# EAGLE design 4x4keyboard (EAGLE 7.7.0)
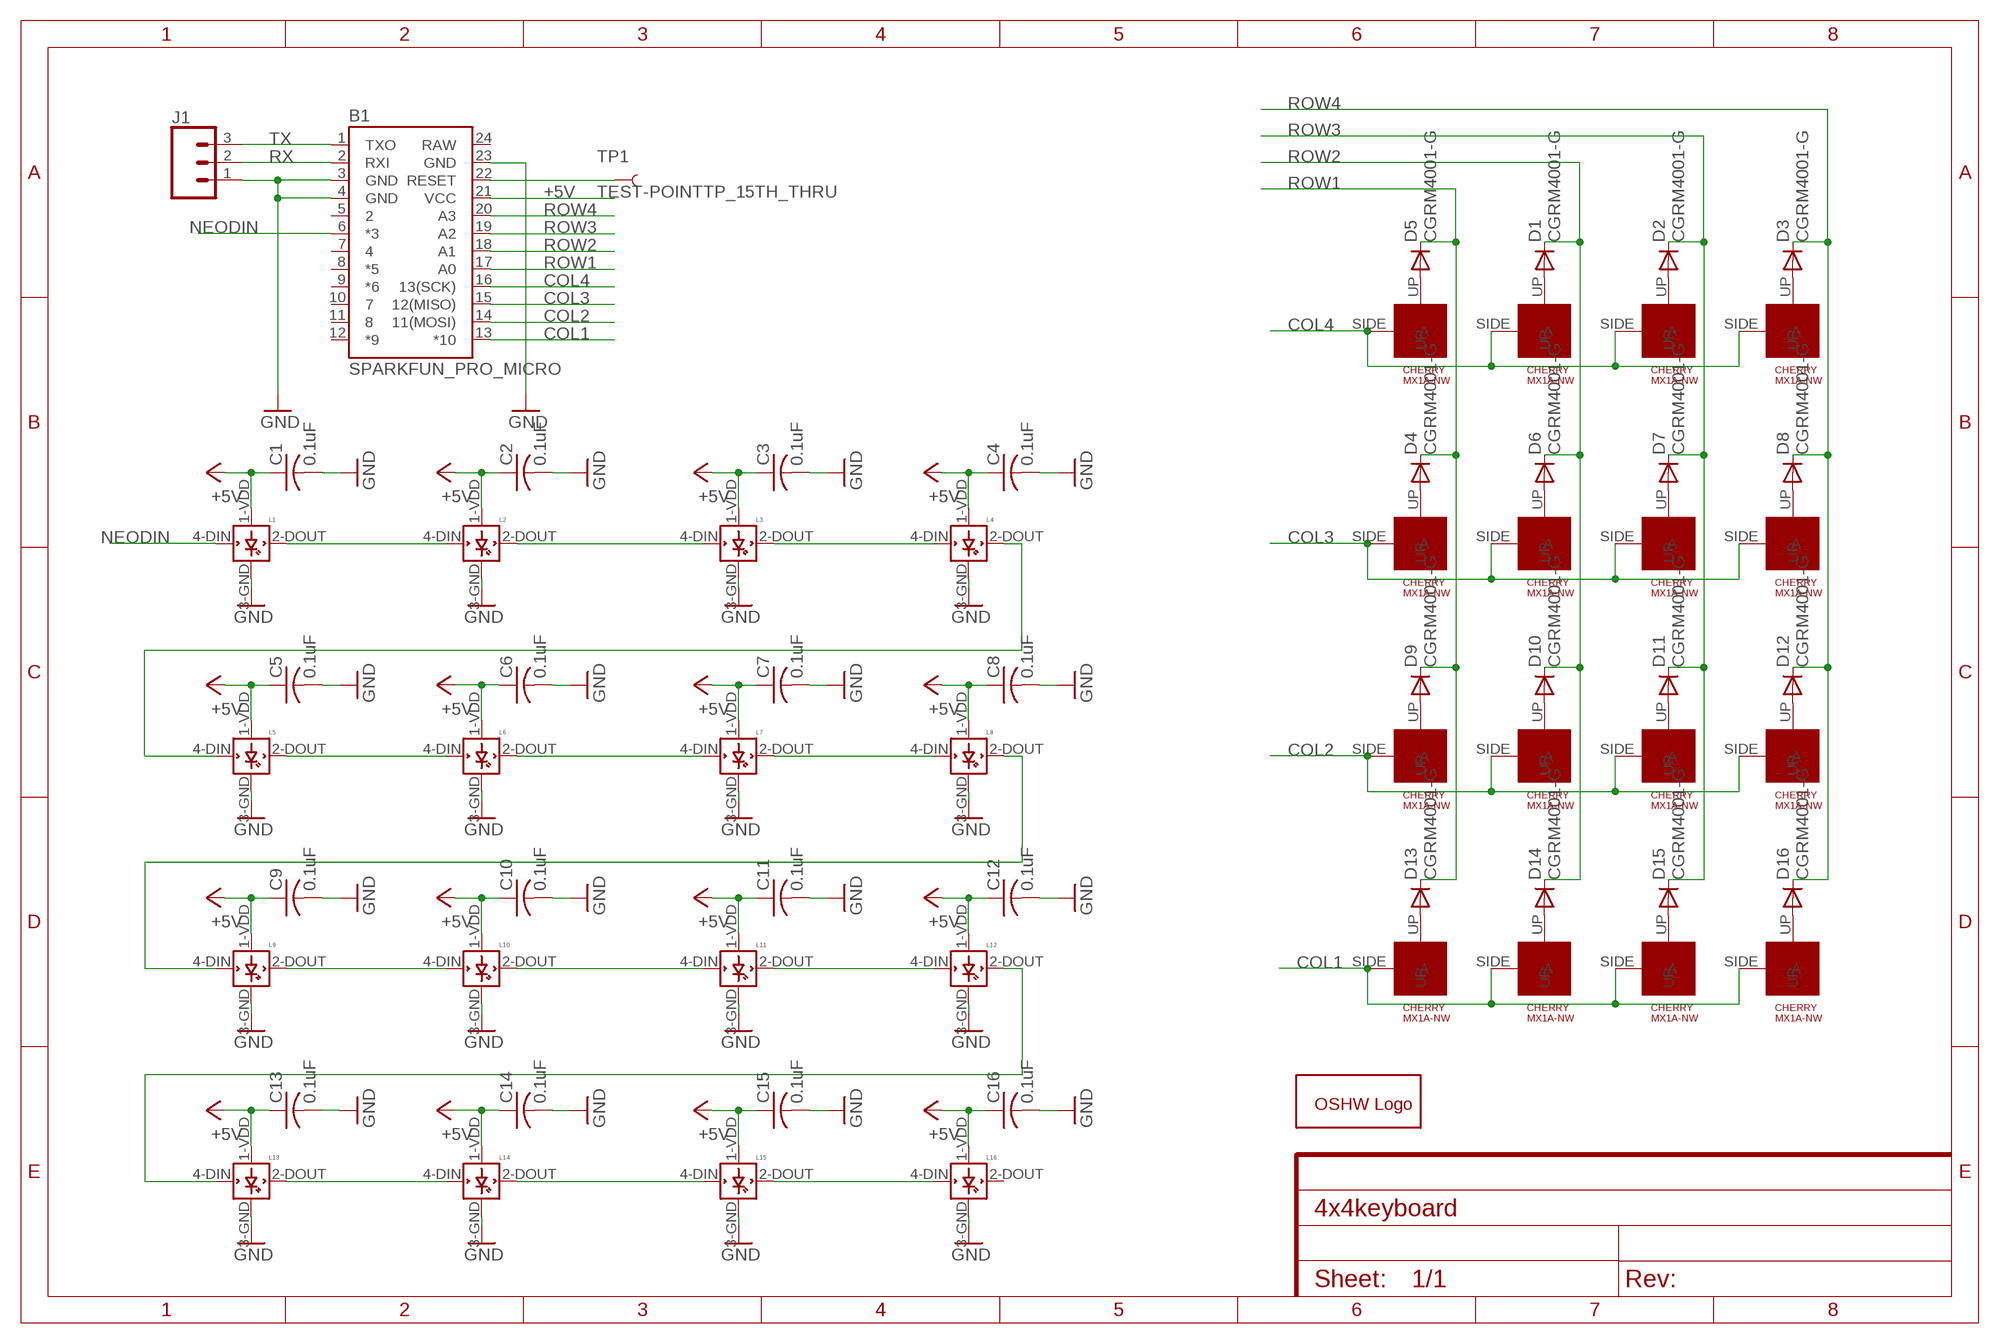
[diagram p0: schematic, sheet 1]

## Parts
B1  SPARKFUN_PRO_MICRO  [SPARKFUN_PRO_MICRO]
C1  0.1uF  C-USC0603  [C0603]
C2  0.1uF  C-USC0603  [C0603]
C3  0.1uF  C-USC0603  [C0603]
C4  0.1uF  C-USC0603  [C0603]
C5  0.1uF  C-USC0603  [C0603]
C6  0.1uF  C-USC0603  [C0603]
C7  0.1uF  C-USC0603  [C0603]
C8  0.1uF  C-USC0603  [C0603]
C9  0.1uF  C-USC0603  [C0603]
C10  0.1uF  C-USC0603  [C0603]
C11  0.1uF  C-USC0603  [C0603]
C12  0.1uF  C-USC0603  [C0603]
C13  0.1uF  C-USC0603  [C0603]
C14  0.1uF  C-USC0603  [C0603]
C15  0.1uF  C-USC0603  [C0603]
C16  0.1uF  C-USC0603  [C0603]
D1  CGRM4001-G  [SOD-123_MINI-SMA]
D2  CGRM4001-G  [SOD-123_MINI-SMA]
D3  CGRM4001-G  [SOD-123_MINI-SMA]
D4  CGRM4001-G  [SOD-123_MINI-SMA]
D5  CGRM4001-G  [SOD-123_MINI-SMA]
D6  CGRM4001-G  [SOD-123_MINI-SMA]
D7  CGRM4001-G  [SOD-123_MINI-SMA]
D8  CGRM4001-G  [SOD-123_MINI-SMA]
D9  CGRM4001-G  [SOD-123_MINI-SMA]
D10  CGRM4001-G  [SOD-123_MINI-SMA]
D11  CGRM4001-G  [SOD-123_MINI-SMA]
D12  CGRM4001-G  [SOD-123_MINI-SMA]
D13  CGRM4001-G  [SOD-123_MINI-SMA]
D14  CGRM4001-G  [SOD-123_MINI-SMA]
D15  CGRM4001-G  [SOD-123_MINI-SMA]
D16  CGRM4001-G  [SOD-123_MINI-SMA]
GOLD_ORB_SM1  OSHWLOGOLOGO5MM  [OSHW_5MM]
J1  CONN_03LOCK  [1X03_LOCK]
L1  WS2812B  [WS2812B]
L2  WS2812B  [WS2812B]
L3  WS2812B  [WS2812B]
L4  WS2812B  [WS2812B]
L5  WS2812B  [WS2812B]
L6  WS2812B  [WS2812B]
L7  WS2812B  [WS2812B]
L8  WS2812B  [WS2812B]
L9  WS2812B  [WS2812B]
L10  WS2812B  [WS2812B]
L11  WS2812B  [WS2812B]
L12  WS2812B  [WS2812B]
L13  WS2812B  [WS2812B]
L14  WS2812B  [WS2812B]
L15  WS2812B  [WS2812B]
L16  WS2812B  [WS2812B]
TP1  TEST-POINTTP_15TH_THRU  [TP_15TH]
U$1  CHERRY-MX1A-E1NW  [CHERRYMX-NN]
U$2  CHERRY-MX1A-E1NW  [CHERRYMX-NN]
U$3  CHERRY-MX1A-E1NW  [CHERRYMX-NN]
U$4  CHERRY-MX1A-E1NW  [CHERRYMX-NN]
U$7  CHERRY-MX1A-E1NW  [CHERRYMX-NN]
U$8  CHERRY-MX1A-E1NW  [CHERRYMX-NN]
U$9  CHERRY-MX1A-E1NW  [CHERRYMX-NN]
U$10  CHERRY-MX1A-E1NW  [CHERRYMX-NN]
U$19  CHERRY-MX1A-E1NW  [CHERRYMX-NN]
U$20  CHERRY-MX1A-E1NW  [CHERRYMX-NN]
U$21  CHERRY-MX1A-E1NW  [CHERRYMX-NN]
U$22  CHERRY-MX1A-E1NW  [CHERRYMX-NN]
U$25  CHERRY-MX1A-E1NW  [CHERRYMX-NN]
U$26  CHERRY-MX1A-E1NW  [CHERRYMX-NN]
U$27  CHERRY-MX1A-E1NW  [CHERRYMX-NN]
U$28  CHERRY-MX1A-E1NW  [CHERRYMX-NN]

## Nets
+5V: B1.21(VCC) C1.1 C2.1 C3.1 C4.1 C5.1 C6.1 C7.1 C8.1 C9.1 C10.1 C11.1 C12.1 C13.1 C14.1 C15.1 C16.1 L1.1-VDD(VDD) L2.1-VDD(VDD) L3.1-VDD(VDD) L4.1-VDD(VDD) L5.1-VDD(VDD) L6.1-VDD(VDD) L7.1-VDD(VDD) L8.1-VDD(VDD) L9.1-VDD(VDD) L10.1-VDD(VDD) L11.1-VDD(VDD) L12.1-VDD(VDD) L13.1-VDD(VDD) L14.1-VDD(VDD) L15.1-VDD(VDD) L16.1-VDD(VDD)
COL1: B1.13(*10) U$25.SIDE(A) U$26.SIDE(A) U$27.SIDE(A) U$28.SIDE(A)
COL2: B1.14(11(MOSI)) U$7.SIDE(A) U$8.SIDE(A) U$9.SIDE(A) U$10.SIDE(A)
COL3: B1.15(12(MISO)) U$1.SIDE(A) U$2.SIDE(A) U$3.SIDE(A) U$4.SIDE(A)
COL4: B1.16(13(SCK)) U$19.SIDE(A) U$20.SIDE(A) U$21.SIDE(A) U$22.SIDE(A)
GND: B1.3(GND) B1.4(GND) B1.23(GND) C1.2 C2.2 C3.2 C4.2 C5.2 C6.2 C7.2 C8.2 C9.2 C10.2 C11.2 C12.2 C13.2 C14.2 C15.2 C16.2 J1.1 L1.3-GND(GND) L2.3-GND(GND) L3.3-GND(GND) L4.3-GND(GND) L5.3-GND(GND) L6.3-GND(GND) L7.3-GND(GND) L8.3-GND(GND) L9.3-GND(GND) L10.3-GND(GND) L11.3-GND(GND) L12.3-GND(GND) L13.3-GND(GND) L14.3-GND(GND) L15.3-GND(GND) L16.3-GND(GND)
N$1: D5.A U$19.UP
N$2: D1.A U$20.UP
N$3: D2.A U$21.UP
N$4: D3.A U$22.UP
N$5: L1.2-DOUT(DOUT) L2.4-DIN(DIN)
N$6: L2.2-DOUT(DOUT) L3.4-DIN(DIN)
N$7: D4.A U$2.UP
N$8: D6.A U$1.UP
N$9: D7.A U$3.UP
N$10: D8.A U$4.UP
N$11: L3.2-DOUT(DOUT) L4.4-DIN(DIN)
N$12: L4.2-DOUT(DOUT) L5.4-DIN(DIN)
N$13: L5.2-DOUT(DOUT) L6.4-DIN(DIN)
N$14: L6.2-DOUT(DOUT) L7.4-DIN(DIN)
N$15: L7.2-DOUT(DOUT) L8.4-DIN(DIN)
N$16: L8.2-DOUT(DOUT) L9.4-DIN(DIN)
N$17: L9.2-DOUT(DOUT) L10.4-DIN(DIN)
N$18: L10.2-DOUT(DOUT) L11.4-DIN(DIN)
N$19: D9.A U$7.UP
N$20: D10.A U$8.UP
N$21: D11.A U$9.UP
N$22: D12.A U$10.UP
N$23: L11.2-DOUT(DOUT) L12.4-DIN(DIN)
N$24: L12.2-DOUT(DOUT) L13.4-DIN(DIN)
N$25: D13.A U$25.UP
N$26: D14.A U$26.UP
N$27: D15.A U$27.UP
N$28: D16.A U$28.UP
N$29: L13.2-DOUT(DOUT) L14.4-DIN(DIN)
N$30: L14.2-DOUT(DOUT) L15.4-DIN(DIN)
N$31: L15.2-DOUT(DOUT) L16.4-DIN(DIN)
NEODIN: B1.6(*3) L1.4-DIN(DIN)
RESET: B1.22(RESET) TP1.P$1
ROW1: B1.17(A0) D4.C D5.C D9.C D13.C
ROW2: B1.18(A1) D1.C D6.C D10.C D14.C
ROW3: B1.19(A2) D2.C D7.C D11.C D15.C
ROW4: B1.20(A3) D3.C D8.C D12.C D16.C
RX: B1.2(RXI) J1.2
TX: B1.1(TXO) J1.3
Unconnected: B1.5 B1.7 B1.8(*5) B1.9(*6) B1.10 B1.11 B1.12(*9) L16.2-DOUT(DOUT)

## Power pins joined to a net without a drawn wire
RAW: B1.24(RAW)

## Library data of the parts
B1 = SparkFun-Boards:SPARKFUN_PRO_MICRO: SparkFun Pro Micro Atmega32U4 compatible footprint. SparkFun Products: 3.3V/8MHz <https://www.sparkfun.com/products/12587> 5V/16MHz <https://www.sparkfun.com/products/12640>
C1-C16 = resistor:C-US: CAPACITOR, American symbol
D1-D16 = diode:CGRM400*-G: Molded plasitc,JEDEC SOD-123/Mini SMA Source: Comchip CGRM4001-G.pdf
GOLD_ORB_SM1 = oshw:OSHWLOGO: The OSHW logo for PCB layout
J1 = SparkFun-Connectors:CONN_03: Multi connection point. Often used as Generic Header-pin footprint for 0.1 inch spaced/style header connections On any of the 0.1 inch spaced packages, you can populate with these: Break Away Headers - Straight <https://www.sparkfun.com/products/116> (PRT-00116) Break Away Male Headers - Right Angle <https://www.sparkfun.com/products/553> (PRT-00553) Female Headers <https://www.sparkfun.com/products/115> (PRT-00115) Break Away Headers - Machine Pin <https://www.sparkfun.com/products/117> (PRT-00117) Break Away Female Headers - Swiss Machine Pin <https://www.sparkfun.com/products/743> (PRT-00743) Stackable Header - 3 Pin (Female, 0.1") <https://www.sparkfun.com/products/13875> (PRT-13875) For SCREWTERMINALS and SPRING TERMINALS visit here: Screw Terimnals on SparkFun.com <https://www.sparkfun.com/search/results?term=Screw+Terminals> (5mm/3.5mm/2.54mm spacing) This device is also useful as a general connection point to wire up your design to another part of your project. Our various solder wires solder well into these plated through hole pads. Hook-Up Wire - Assortment (Stranded, 22 AWG) <https://www.sparkfun.com/products/11375> (PRT-11375) Hook-Up Wire - Assortment (Solid Core, 22 AWG) <https://www.sparkfun.com/products/11367> (PRT-11367) View the entire wire category on our website here <https://www.sparkfun.com/categories/141> Special notes: Molex polarized connector foot print use with SKU : PRT-08232 with associated crimp pins and housings.
L1-L16 = adafruit:WS2812B
TP1 = SparkFun-Connectors:TEST-POINT: SparkFun Test Points Bare copper test points for troubleshooting or In-Circuit-Testing. These are used by our Production team for verifying production board runs using pogo-pins on test beds. SparkFun Products: SparkFun LSM9DS1 Breakout <https://www.sparkfun.com/products/13284> SparkFun PSOC <https://www.sparkfun.com/products/13714> SparkFun Load Cell Amplifier <https://www.sparkfun.com/products/13879>
U$1-U$4 U$7-U$10 U$19-U$22 U$25-U$28 = my_parts:CHERRY-MX1A-E1NW: Cherry MX NW key

## Board
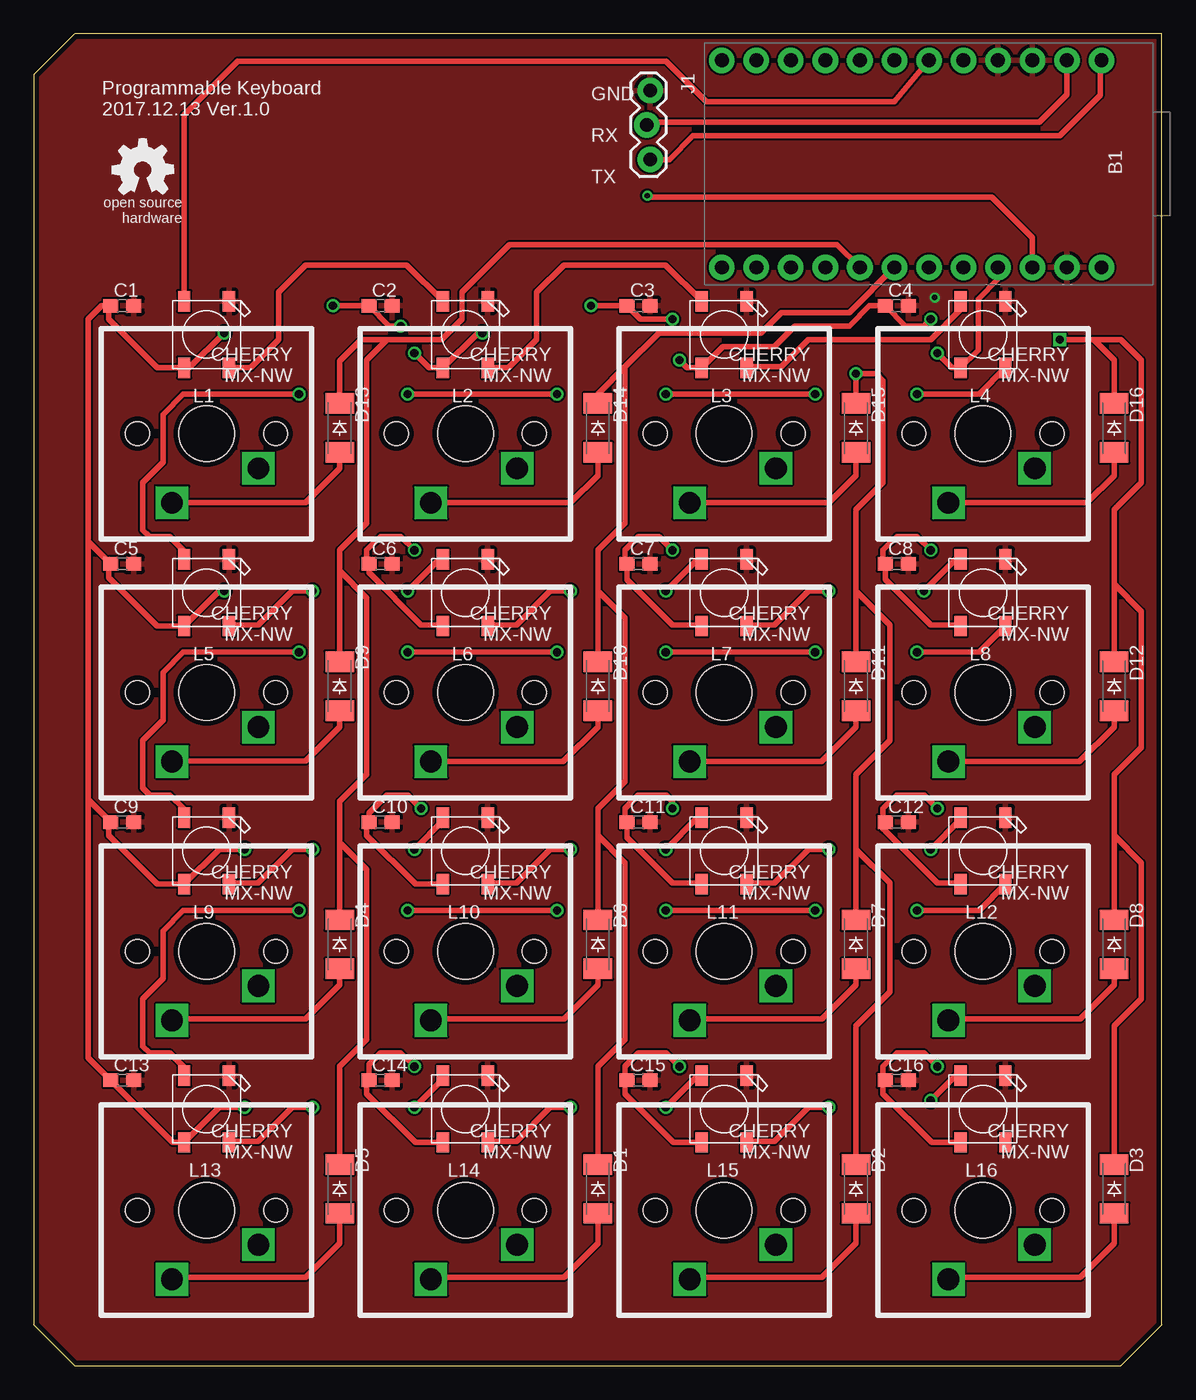
[diagram p1: board, top side]
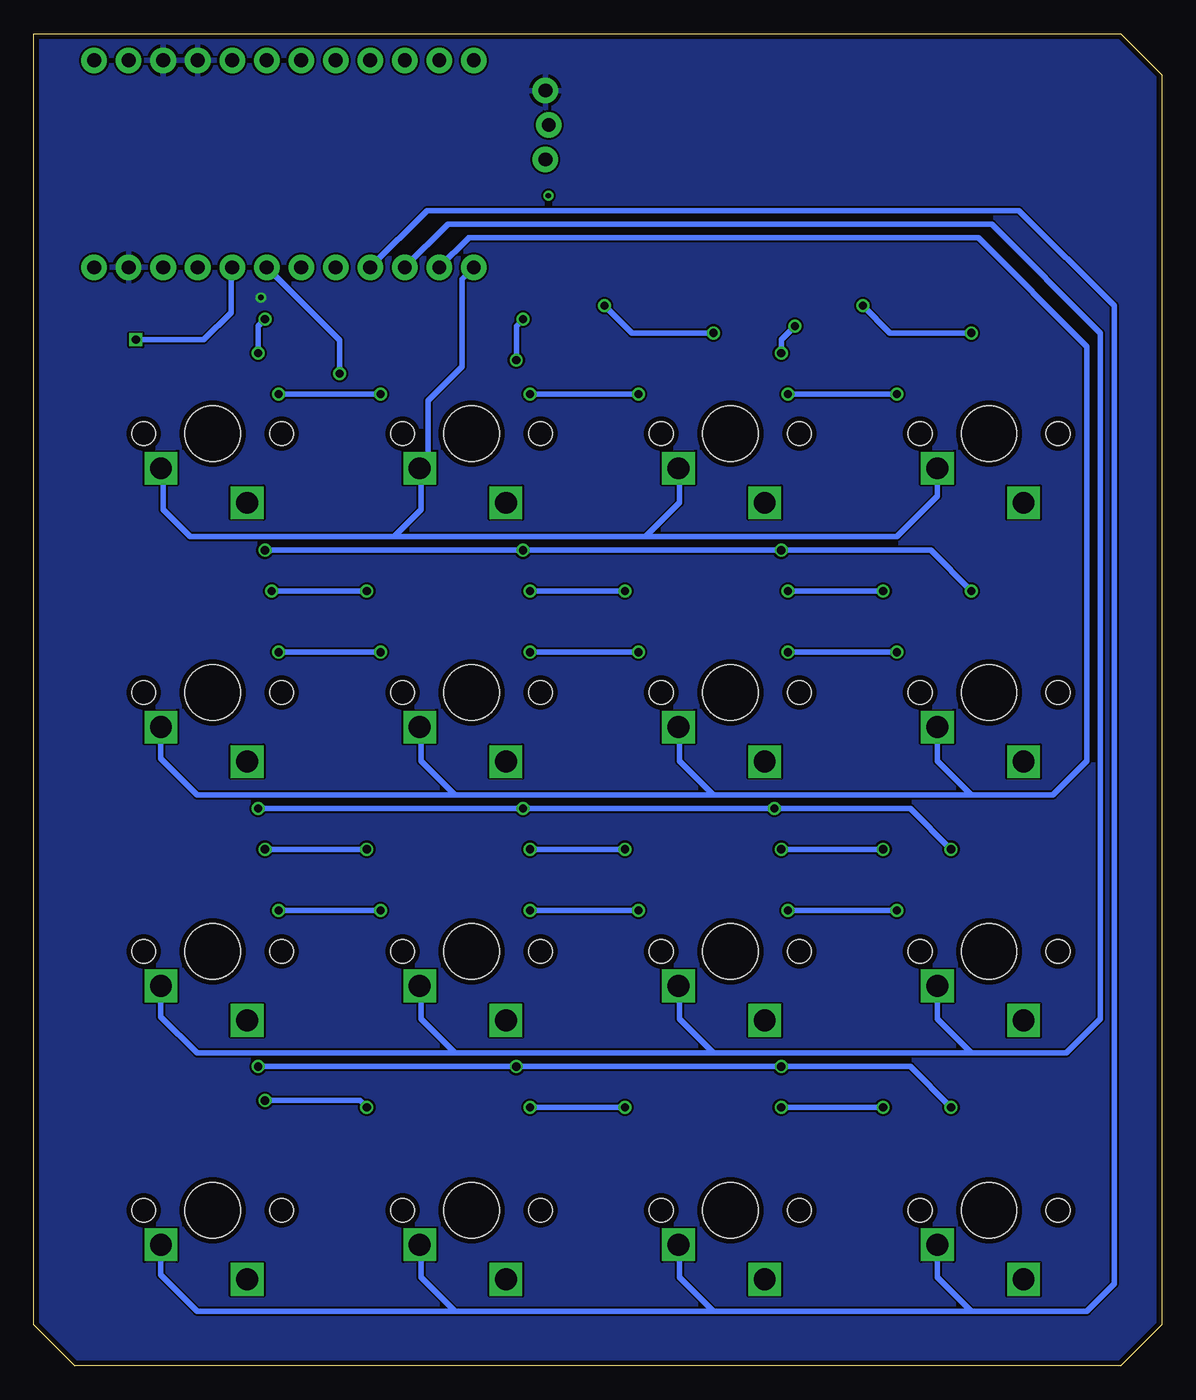
[diagram p2: board, bottom side, seen from below]

Size 83 x 98 mm. Coordinates in mm from the lower left corner, seen from the top.
Outline: 3,0 5,0 80,0 83,3 83,98 3,98 0,95 0,5 0,3 3,0
Copper layers (1*16): Top 0.0356mm / dielectric 1.5011mm / Bottom 0.0356mm
Design rules "LaenPCBOrder": minimum track width 6mil, minimum drill 13mil, track to track 6mil, track to pad 6mil, pad to pad 6mil, via to via 6mil, smd to smd 6mil, copper to edge 15mil, drill to drill 6mil, minimum pad ring 7mil, minimum via ring 7mil, stop-mask expansion 4mil, vias tented up to drill 0mil, thermal gap 10mil

### Footprints (pad centres in the part's own frame; a part is rotated, then mirrored left to right if it is on the bottom)
SPARKFUN_PRO_MICRO = drill 1.016 pad 1.88: 1 -7.62,12.7; 2 -7.62,10.16; 3 -7.62,7.62; 4 -7.62,5.08; 5 -7.62,2.54; 6 -7.62,0; 7 -7.62,-2.54; 8 -7.62,-5.08; 9 -7.62,-7.62; 10 -7.62,-10.16; 11 -7.62,-12.7; 12 -7.62,-15.24; 13 7.62,-15.24; 14 7.62,-12.7; 15 7.62,-10.16; 16 7.62,-7.62; 17 7.62,-5.08; 18 7.62,-2.54; 19 7.62,0; 20 7.62,2.54; 21 7.62,5.08; 22 7.62,7.62; 23 7.62,10.16; 24 7.62,12.7
C0603 = smd 1.1 x 1: 1 -0.85,0; 2 0.85,0
SOD-123_MINI-SMA = smd 1.5 x 2.1: A 1.8,0; C -1.8,0
1X03_LOCK = drill 1.016 pad 1.88: 1 0,0.127; 2 2.54,-0.127; 3 5.08,0.127
WS2812B = smd 1.5 x 0.9: 1-VDD 2.45,-1.65; 2-DOUT 2.45,1.65; 3-GND -2.45,1.65; 4-DIN -2.45,-1.65
TP_15TH = drill 0.381 pad 0.61: P$1 0,0
CHERRYMX-NN = drill 1.6 square: SIDE -3.81,2.54; UP 2.54,5.08 | hole 1.753: -5.08,0; 5.08,0 | hole 4.089: 0,0

### Placement (x,y rotation side)
B1  65.87,88.44 270 top
C1  6.5,78 0 top
C2  25.5,78 0 top
C3  44.5,78 0 top
C4  63.5,78 0 top
C5  6.5,59 0 top
C6  25.5,59 0 top
C7  44.5,59 0 top
C8  63.5,59 0 top
C9  6.5,40 0 top
C10  25.5,40 0 top
C11  44.5,40 0 top
C12  63.5,40 0 top
C13  6.5,21 0 top
C14  25.5,21 0 top
C15  44.5,21 0 top
C16  63.5,21 0 top
D1  41.5,13 270 top
D2  60.5,13 270 top
D3  79.5,13 270 top
D4  22.5,31 270 top
D5  22.5,13 270 top
D6  41.5,31 270 top
D7  60.5,31 270 top
D8  79.5,31 270 top
D9  22.5,50 270 top
D10  41.5,50 270 top
D11  60.5,50 270 top
D12  79.5,50 270 top
D13  22.5,69 270 top
D14  41.5,69 270 top
D15  60.5,69 270 top
D16  79.5,69 270 top
GOLD_ORB_SM1  8,88 0 top
J1  45.23,93.84 270 top
L1  12.7,75.88 270 top
L2  31.75,75.88 270 top
L3  50.8,75.88 270 top
L4  69.85,75.88 270 top
L5  12.7,56.88 270 top
L6  31.75,56.88 270 top
L7  50.8,56.88 270 top
L8  69.85,56.88 270 top
L9  12.7,37.88 270 top
L10  31.75,37.88 270 top
L11  50.8,37.88 270 top
L12  69.85,37.88 270 top
L13  12.7,18.88 270 top
L14  31.75,18.88 270 top
L15  50.8,18.88 270 top
L16  69.85,18.88 270 top
TP1  45.14,86.1 0 top
U$1  31.75,30.48 180 top
U$2  12.7,30.48 180 top
U$3  50.8,30.48 180 top
U$4  69.85,30.48 180 top
U$7  12.7,49.53 180 top
U$8  31.75,49.53 180 top
U$9  50.8,49.53 180 top
U$10  69.85,49.53 180 top
U$19  12.7,11.43 180 top
U$20  31.75,11.43 180 top
U$21  50.8,11.43 180 top
U$22  69.85,11.43 180 top
U$25  12.7,68.58 180 top
U$26  31.75,68.58 180 top
U$27  50.8,68.58 180 top
U$28  69.85,68.58 180 top

### Tracks (layer width: path | path; a pad name or v marks a point on that pad's centre or on a via)
+5V  (via drill 0.6)
  Top 0.406: B1.21 70.95,79.95 69.5,78.5 69.5,74.73 L4.1-VDD 67.57,73.43 v66.5,74.5 | v22,78 C2.1 26.15,76.5 v27,76.5 | v14,76 11.43,73.43 L1.1-VDD 9.07,73.43 5.5,77 5.5,77.85 C1.1 5,78 4,77 4,60.65 | v33,76 32.67,76 L2.1-VDD 29.07,73.43 v28,74.5 | v41,78 C3.1 44.65,77 v47,77 | v47.5,74 48.07,73.43 L3.1-VDD 50.72,75 54.5,75 56,76.5 60,76.5 61.5,78 C4.1 64.15,76.5 65.5,76.5 v66,77 | 4,60.65 C5.1 5.5,58.85 5.5,58 9.07,54.43 L5.1-VDD 13.62,57 v14,57 | 4,41.65 C9.1 5.5,39.85 5.5,39 9.07,35.43 L9.1-VDD 13.62,38 v15.5,38 | 4,41.65 4,60.65 | 4,41.65 4,22.65 C13.1 10.22,16.43 L13.1-VDD 13.62,19 v15.5,19 | v28,60 27,61 25.5,61 24.5,60 24.5,59.5 24.65,59.35 C6.1 24.65,58.35 28.5,54.5 30.03,54.5 L6.1-VDD | v47,60 46,61 44.5,61 43.5,60 43.5,59.15 C7.1 43.65,57.85 47,54.5 49.08,54.5 L7.1-VDD | v66,60 65,61 63.5,61 62.5,60 62.5,59.15 C8.1 62.65,57.85 66,54.5 68.13,54.5 L8.1-VDD | L10.1-VDD 28.07,35.43 24.5,39 24.5,39.85 C10.1 24.65,40.65 26,42 27.5,42 v28.5,41 | L11.1-VDD 49.08,35.5 47,35.5 43.65,38.85 C11.1 43.5,40.15 43.5,41 44.5,42 46.5,42 47,41.5 v47,41 | L12.1-VDD 68.13,35.5 66.5,35.5 62.65,39.35 | 62.65,39.35 C12.1 | 62.65,39.35 62.5,39.5 62.5,41 63.5,42 65.5,42 v66.5,41 | v28,22 27,23 25.5,23 24.65,22.15 C14.1 24.5,20.85 24.5,20 28.07,16.43 L14.1-VDD | C15.1 43.5,20.85 | 43.5,20.85 43.5,20 47.07,16.43 L15.1-VDD | C16.1 62.5,20.85 | 62.5,20.85 62.5,20 66.07,16.43 L16.1-VDD | 43.5,20.85 43.5,22 44.5,23 46.5,23 v47.5,22 | 62.5,20.85 62.5,22 63.5,23 65.5,23 v66.5,22
  Bottom 0.406: v22,78 20,76 v14,76 | v33,76 39,76 v41,78 | v27,76.5 28,75.5 v28,74.5 | v47,77 47.5,76.5 v47.5,74 | v66,77 66.5,76.5 v66.5,74.5 | v14,57 17,60 v28,60 v47,60 v66,60 | v15.5,38 18.5,41 v28.5,41 v47,41 v66.5,41 | v15.5,19 18.5,22 v28,22 v47.5,22 v66.5,22
COL1
  Bottom 0.406: B1.13 51.5,79.95 51.5,73.5 54,71 54,67 54.5,66.5 | 54.5,66.5 54.61,66.39 U$27.SIDE | U$28.SIDE 73.5,65.88 73.5,63 71.5,61 57.5,61 56.5,61 | 56.5,61 38,61 | 38,61 19.5,61 16.51,63.99 U$25.SIDE | U$26.SIDE 35.5,65.98 35.5,63.5 38,61 | 54.5,66.5 54.5,63 56.5,61
COL2
  Bottom 0.406: B1.14 51,82.99 51,83 13.5,83 5.5,75 5.5,44.5 8,42 13.5,42 14,42 | 14,42 33,42 | 33,42 52,42 | 52,42 71,42 73.66,44.66 U$10.SIDE | U$9.SIDE 54.5,46.88 54.5,44.5 52,42 | U$8.SIDE 35.5,46.93 35.5,44.5 33,42 | U$7.SIDE 16.5,44.5 14,42
COL3
  Bottom 0.406: B1.15 52.53,84 12.5,84 4.5,76 4.5,25.5 7,23 14,23 | 14,23 33,23 | 33,23 52,23 | 52,23 71,23 73.66,25.66 U$4.SIDE | U$3.SIDE 54.5,27.83 54.5,25.5 52,23 | U$1.SIDE 35.5,27.88 35.5,25.5 33,23 | U$2.SIDE 16.5,25.5 14,23
COL4
  Bottom 0.406: B1.16 54.07,85 10.5,85 3.5,78 3.5,6 5.5,4 14,4 | 14,4 33,4 | 33,4 52,4 | 52,4 71,4 73.66,6.66 U$22.SIDE | U$21.SIDE 54.5,8.78 54.5,6.5 52,4 | U$20.SIDE 35.5,8.83 35.5,6.5 33,4 | U$19.SIDE 16.5,6.5 14,4
GND  (via drill 0.4)
  other vias: 66.3,78.6
  pour Bottom: 0,97.84 82.79,98.11 82.79,-0.73 0,0
  pour Top: 0,97.84 82.79,97.84 82.79,0 0,0
N$1
  Top 0.406: D5.A 22.5,9 20,6.5 10.31,6.5 U$19.UP
N$2
  Top 0.406: D1.A 41.5,9 39,6.5 29.36,6.5 U$20.UP
N$3
  Top 0.406: D2.A 60.5,9 58,6.5 48.41,6.5 U$21.UP
N$4
  Top 0.406: D3.A 79.5,9 77,6.5 67.46,6.5 U$22.UP
N$5
  Top 0.406: L1.2-DOUT 15.93,73.43 18,75.5 18,79 20,81 27.43,81 L2.4-DIN
N$6
  Top 0.406: L2.2-DOUT 34.93,73.43 37,75.5 37,79 39,81 46.48,81 L3.4-DIN
N$7
  Top 0.406: D4.A 22.5,28 20,25.5 10.26,25.5 U$2.UP
N$8
  Top 0.406: D6.A 41.5,28 39,25.5 29.31,25.5 U$1.UP
N$9
  Top 0.406: D7.A 60.5,28 58,25.5 48.36,25.5 U$3.UP
N$10
  Top 0.406: D8.A 79.5,28 77,25.5 67.41,25.5 U$4.UP
N$11
  Top 0.406: L4.4-DIN 68.2,77.7 66,75.5 57,75.5 55,73.5 52.52,73.5 L3.2-DOUT
N$12  (via drill 0.6)
  Top 0.406: L4.2-DOUT 69.57,71.5 v65,71.5 | v57.5,71.5 v46.5,71.5 | v38.5,71.5 v27.5,71.5 | v19.5,71.5 11,71.5 9.5,70 9.5,66.5 8,65 8,61.5 8.5,61 10,61 11.05,59.95 L5.4-DIN
  Bottom 0.406: v65,71.5 v57.5,71.5 | v46.5,71.5 v38.5,71.5 | v27.5,71.5 v19.5,71.5
N$13  (via drill 0.6)
  Top 0.406: L5.2-DOUT 14.42,54.5 16.5,54.5 19,57 v20.5,57 | v27.5,57 29.83,59.33 L6.4-DIN
  Bottom 0.406: v20.5,57 v27.5,57
N$14  (via drill 0.6)
  Top 0.406: L6.2-DOUT 33.47,54.5 35.5,54.5 38,57 v39.5,57 | v46.5,57 48.83,59.33 L7.4-DIN
  Bottom 0.406: v39.5,57 v46.5,57
N$15  (via drill 0.6)
  Top 0.406: L7.2-DOUT 52.52,54.5 54.5,54.5 57,57 v58.5,57 | v65.5,57 67.83,59.33 L8.4-DIN
  Bottom 0.406: v58.5,57 v65.5,57
N$16  (via drill 0.6)
  Top 0.406: L8.2-DOUT 69.57,52.5 v65,52.5 | v57.5,52.5 v46.5,52.5 | v38.5,52.5 v27.5,52.5 | v19.5,52.5 11,52.5 9.5,51 9.5,47.5 8,46 8,42.5 8.5,42 10,42 11.05,40.95 L9.4-DIN
  Bottom 0.406: v65,52.5 v57.5,52.5 | v46.5,52.5 v38.5,52.5 | v27.5,52.5 v19.5,52.5
N$17  (via drill 0.6)
  Top 0.406: L9.2-DOUT 14.42,35.5 16.5,35.5 19,38 v20.5,38 | v28,38 30.1,40.1 L10.4-DIN
  Bottom 0.406: v20.5,38 v28,38
N$18  (via drill 0.6)
  Top 0.406: L10.2-DOUT 33.47,35.5 35.5,35.5 38,38 v39.5,38 | v46.5,38 48.83,40.33 L11.4-DIN
  Bottom 0.406: v39.5,38 v46.5,38
N$19
  Top 0.406: D9.A 22.5,47 20,44.5 10.21,44.5 U$7.UP
N$20
  Top 0.406: U$8.UP 38.95,44.45 41.5,47 D10.A
N$21
  Top 0.406: U$9.UP 57.95,44.45 60.5,47 D11.A
N$22
  Top 0.406: U$10.UP 76.95,44.45 79.5,47 D12.A
N$23  (via drill 0.6)
  Top 0.406: L11.2-DOUT 52.52,35.5 54.5,35.5 57,38 v58.5,38 | v66,38 68.2,40.2 L12.4-DIN
  Bottom 0.406: v58.5,38 v66,38
N$24  (via drill 0.6)
  Top 0.406: L12.2-DOUT 69.57,33.5 v65,33.5 | v57.5,33.5 v46.5,33.5 | v38.5,33.5 v27.5,33.5 | v19.5,33.5 11,33.5 9.5,32 9.5,28.5 8,27 8,23.5 8.5,23 10,23 11.05,21.95 L13.4-DIN
  Bottom 0.406: v65,33.5 v57.5,33.5 | v46.5,33.5 v38.5,33.5 | v27.5,33.5 v19.5,33.5
N$25
  Top 0.406: D13.A 22.5,66 20,63.5 U$25.UP
N$26
  Top 0.406: U$26.UP 39.5,63.5 41.5,65.5 D14.A
N$27
  Top 0.406: U$27.UP 58.5,63.5 60.5,65.5 D15.A
N$28
  Top 0.406: U$28.UP 77.5,63.5 79.5,65.5 D16.A
N$29  (via drill 0.6)
  Top 0.406: L13.2-DOUT 14.42,16.5 16.5,16.5 19,19 v20.5,19 | v28,19 30.1,21.1 L14.4-DIN
  Bottom 0.406: v20.5,19 v28,19
N$30  (via drill 0.6)
  Top 0.406: L14.2-DOUT 33.47,16.5 35.5,16.5 38,19 v39.5,19 | v46.5,19 48.83,21.33 L15.4-DIN
  Bottom 0.406: v39.5,19 v46.5,19
N$31  (via drill 0.6)
  Top 0.406: L15.2-DOUT 52.52,16.5 54.5,16.5 57,19 v58.5,19 | v66,19.5 67.83,21.33 L16.4-DIN
  Bottom 0.406: v58.5,19 59,19.5 v66,19.5
NEODIN
  Top 0.406: L1.4-DIN 11.05,92.05 15,96 46.5,96 49.5,93 63.31,93 B1.6
RESET
  Top 0.406: TP1.P$1 45.24,86 70.5,86 73.49,83.01 B1.22
ROW1
  Top 0.406: B1.17 59.11,82.5 35,82.5 31.5,79 31.5,77 30,75.5 26,75.5 | 26,75.5 24.5,74 24.5,62 22.5,60 22.5,58.5 | 22.5,38.5 22.5,41.5 24.5,43.5 24.5,56.5 22.5,58.5 | 22.5,38.5 24.5,36.5 24.5,24 22.5,22 D5.C | 22.5,32.34 D4.C 22.5,38.5 | 26,75.5 24.07,75.5 22.5,73.94 D13.C | 23,52.3 22.85,52.15 | 22.85,52.15 D9.C | 22.5,58.5 22.5,52.5 22.85,52.15
ROW2
  Top 0.406: B1.18 60.01,77.5 55,77.5 53.5,76 46,76 43.5,73.5 | 43.5,73.5 43.5,62 41.5,60 41.5,57 | 41.5,57 43.5,55 43.5,43 41.5,41 41.5,39 | 41.5,57 41.5,51.84 D10.C | D1.C 41.5,22 43.5,24 43.5,37 41.5,39 | D6.C 41.5,39 | D14.C 41.5,71.5 43.5,73.5
ROW3  (via drill 0.6)
  Top 0.406: D15.C v60.5,73 62,73 62.5,72.5 62.5,65 60.5,63 60.5,57 | D11.C 60.5,57 | D7.C 60.5,38 | 60.5,38 60.5,43.5 63,46 63,54.5 60.5,57 | D2.C 60.5,25 63,27.5 63,35.5 60.5,38
  Bottom 0.406: B1.19 60.5,75.45 v60.5,73
ROW4  (via drill 0.6)
  Top 0.406: D3.C 79.5,25 81.5,27 81.5,37 79.5,39 D8.C 79.5,43.5 81.5,45.5 81.5,55.5 79.5,57.5 D12.C 79.5,63 81.5,65 81.5,74 80,75.5 78,75.5 | 78,75.5 v75.5,75.5 | D16.C 79.5,74 78,75.5
  Bottom 0.406: B1.20 68.5,80.73 68.5,77.5 70.5,75.5 v75.5,75.5
RX
  Top 0.406: J1.2 45.3,91.5 74,91.5 76.03,93.53 B1.2
TX
  Top 0.406: B1.1 78.5,95.99 78.5,93.5 75.5,90.5 48.5,90.5 46.76,88.76 J1.3

### Text on the board
tNames: Programmable Keyboard / 2017.12.13 Ver.1.0 | GND / / RX / / TX